# Altium schematic sheet PROC099A_CoverSheet.SchDoc
size 431 x 279 mm; Date: Not shown in title block; ApprovedBy: Not shown in title block; CheckedBy: Not shown in title block; Author: Not shown in title block; CompanyName: Not shown in title block; DrawnBy: Adrian Ozer; Engineer: Not shown in title block; Organization: Not shown in title block; Address1: Not shown in title block; Address2: Not shown in title block; Address3: Not shown in title block; Address4: Not shown in title block; DocumentNumber: 1; Revision: Use project parameter SCH_Rev; SheetNumber: 1; SheetTotal: 16; PageSetup: Record=PageOptions|CenterHorizontal=True|CenterVertical=True|PrintScale=1.00|XCorrection=1.00|YCorrection=1.00|PrintKind=0|BorderSize=5000000|LeftOffset=0|BottomOffset=0|Orientation=2|PaperLength=1000|PaperWidth=1000|Scale=100|PaperSource=15|PrintQuality=600|MediaType=1|DitherType=10|PaperKind=Letter|PrintScaleMode=1; CurrentTime: Not shown in title block; CurrentDate: Not shown in title block; Time: Not shown in title block; DocumentFullPathAndName: Not shown in title block; DocumentName: Not shown in title block; ModifiedDate: Not shown in title block; ImagePath: Not shown in title block
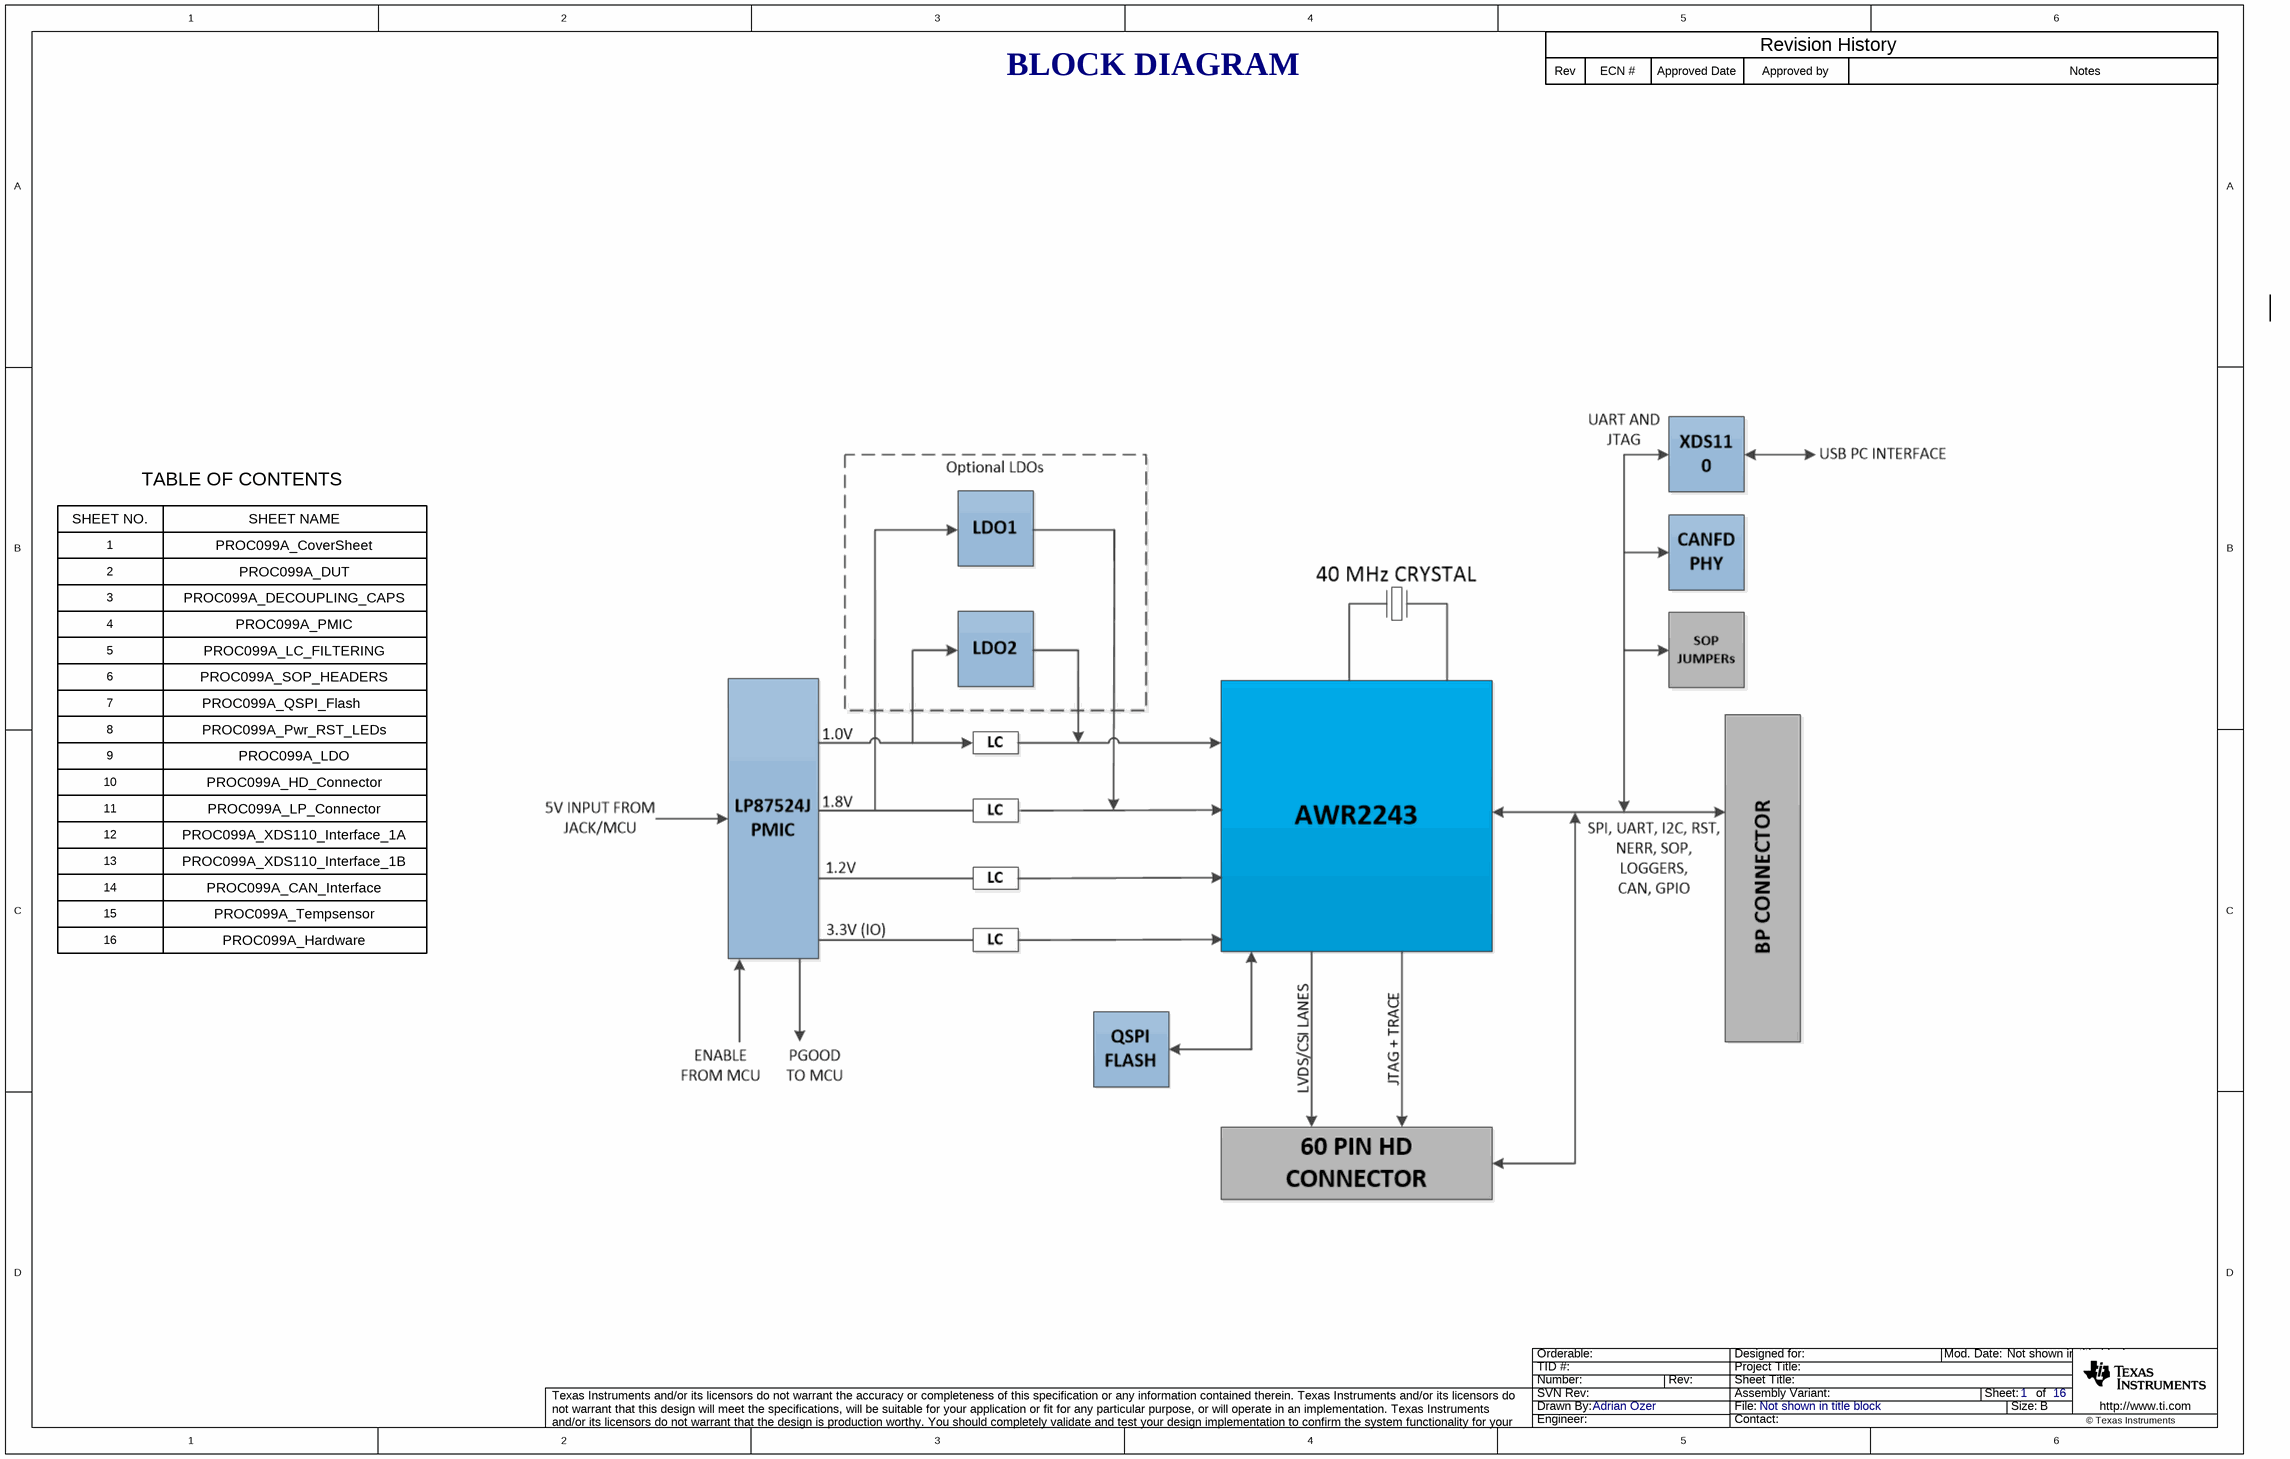
[diagram p0: PROC099A_CoverSheet.SchDoc]

## Notes on the sheet
- BLOCK DIAGRAM
- Rev
- ECN #
- Approved Date
- Approved by
- Revision History
- Notes
- TABLE OF CONTENTS
- SHEET NO.
- 1
- SHEET NAME
- PROC099A_CoverSheet
- 2
- 3
- 4
- PROC099A_DUT
- PROC099A_DECOUPLING_CAPS
- PROC099A_PMIC
- 5
- 6
- PROC099A_LC_FILTERING
- PROC099A_SOP_HEADERS
- 7
- 8
- 9
- PROC099A_QSPI_Flash
- PROC099A_Pwr_RST_LEDs
- PROC099A_LDO
- 11
- 10
- PROC099A_HD_Connector
- PROC099A_LP_Connector
- 12
- 13
- 14
- PROC099A_XDS110_Interface_1A
- PROC099A_XDS110_Interface_1B
- PROC099A_CAN_Interface
- 15
- 16
- PROC099A_Tempsensor
- PROC099A_Hardware
- Drawn By:
- SVN Rev:
- Number:
- TID #:
- Orderable:
- Rev:
- Sheet Title:
- File:
- Project Title:
- Designed for:
- Assembly Variant:
- Mod. Date:
- Sheet:
- Size:
- of
- B
- http://www.ti.com
- Texas Instruments and/or its licensors do not warrant the accuracy or completeness of this specification or any information contained therein. Texas Instruments and/or its licensors do not warrant that this design will meet the specifications, will be suitable for your application or fit for any particular purpose, or will operate in an implementation. Texas Instruments and/or its licensors do not warrant that the design is production worthy. You should completely validate and test your design implementation to confirm the system functionality for your application.
- Engineer:
- Contact:
- © Texas Instruments